# EAGLE design HomemadeHardware_Intro (EAGLE 9.5.2)
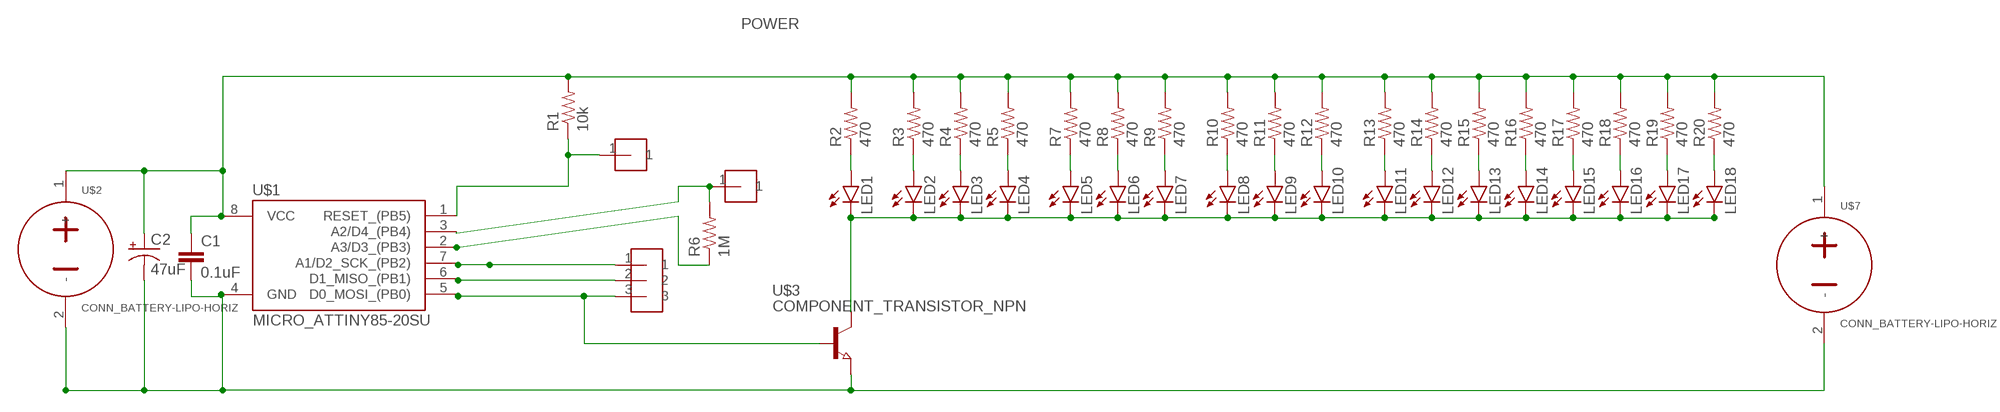
[diagram p0: schematic, sheet 1]

## Parts
C1  0.1uF  COMPONENT_CAP-0805  [0805]
C2  47uF  COMPONENT_CAP_POL-10MM  [CAP_RADIAL_CAN_8MM]
LED1  LED-0805  [CHIP-LED0805]
LED2  LED-0805  [CHIP-LED0805]
LED3  LED-0805  [CHIP-LED0805]
LED4  LED-0805  [CHIP-LED0805]
LED5  LED-0805  [CHIP-LED0805]
LED6  LED-0805  [CHIP-LED0805]
LED7  LED-0805  [CHIP-LED0805]
LED8  LED-0805  [CHIP-LED0805]
LED9  LED-0805  [CHIP-LED0805]
LED10  LED-0805  [CHIP-LED0805]
LED11  LED-0805  [CHIP-LED0805]
LED12  LED-0805  [CHIP-LED0805]
LED13  LED-0805  [CHIP-LED0805]
LED14  LED-0805  [CHIP-LED0805]
LED15  LED-0805  [CHIP-LED0805]
LED16  LED-0805  [CHIP-LED0805]
LED17  LED-0805  [CHIP-LED0805]
LED18  LED-0805  [CHIP-LED0805]
R1  10k  COMPONENT_RESISTOR-0805  [0805]
R2  470  COMPONENT_RESISTOR-0805  [0805]
R3  470  COMPONENT_RESISTOR-0805  [0805]
R4  470  COMPONENT_RESISTOR-0805  [0805]
R5  470  COMPONENT_RESISTOR-0805  [0805]
R6  1M  COMPONENT_RESISTOR-0805  [0805]
R7  470  COMPONENT_RESISTOR-0805  [0805]
R8  470  COMPONENT_RESISTOR-0805  [0805]
R9  470  COMPONENT_RESISTOR-0805  [0805]
R10  470  COMPONENT_RESISTOR-0805  [0805]
R11  470  COMPONENT_RESISTOR-0805  [0805]
R12  470  COMPONENT_RESISTOR-0805  [0805]
R13  470  COMPONENT_RESISTOR-0805  [0805]
R14  470  COMPONENT_RESISTOR-0805  [0805]
R15  470  COMPONENT_RESISTOR-0805  [0805]
R16  470  COMPONENT_RESISTOR-0805  [0805]
R17  470  COMPONENT_RESISTOR-0805  [0805]
R18  470  COMPONENT_RESISTOR-0805  [0805]
R19  470  COMPONENT_RESISTOR-0805  [0805]
R20  470  COMPONENT_RESISTOR-0805  [0805]
U$1  MICRO_ATTINY85-20SU  [SOIC8]
U$2  CONN_BATTERY-LIPO-HORIZ  [JST-PH-2-SMT-RA]
U$3  COMPONENT_TRANSISTOR_NPN  [SOT23]
U$4  HEADER-1-TESTPOINT  [TESTPOINT-1]
U$5  HEADER-1-TESTPOINT  [TESTPOINT-1]
U$6  HEADER-3-TESTPOINT  [TESTPOINT-3]
U$7  CONN_BATTERY-LIPO-HORIZ  [JST-PH-2-SMT-RA]

## Nets
N$1: R1.1 U$1.1(RESET_(PB5)) U$5.1
N$2: C1.2 C2.- U$1.4(GND) U$2.2(-) U$3.2(E) U$7.2(-)
N$4: LED14.A R16.1
N$5: R6.2 U$1.3(A2/D4_(PB4)) U$4.1
N$6: LED1.C LED2.C LED3.C LED4.C LED5.C LED6.C LED7.C LED8.C LED9.C LED10.C LED11.C LED12.C LED13.C LED14.C LED15.C LED16.C LED17.C LED18.C U$3.3(C)
N$7: LED4.A R5.1
N$8: LED3.A R4.1
N$9: LED2.A R3.1
N$10: LED1.A R2.1
N$11: R6.1 U$1.2(A3/D3_(PB3))
N$12: U$1.5(D0_MOSI_(PB0)) U$3.1(B) U$6.3
N$13: U$1.7(A1/D2_SCK_(PB2)) U$6.1
N$14: U$1.6(D1_MISO_(PB1)) U$6.2
N$16: LED7.A R9.1
N$17: LED6.A R8.1
N$18: LED5.A R7.1
N$19: LED15.A R17.1
N$21: LED10.A R12.1
N$22: LED9.A R11.1
N$23: LED8.A R10.1
N$24: LED16.A R18.1
N$26: LED13.A R15.1
N$27: LED12.A R14.1
N$28: LED11.A R13.1
N$29: LED17.A R19.1
N$31: LED18.A R20.1
POWER: C1.1 C2.+ R1.2 R2.2 R3.2 R4.2 R5.2 R7.2 R8.2 R9.2 R10.2 R11.2 R12.2 R13.2 R14.2 R15.2 R16.2 R17.2 R18.2 R19.2 R20.2 U$1.8(VCC) U$2.1(+) U$7.1(+)

## Library data of the parts
C1 = homemade-hardware:COMPONENT_CAP: Capacitor Standard 0603 ceramic capacitor, and 0.1" leaded capacitor.
C2 = homemade-hardware:COMPONENT_CAP_POL: Capacitor Polarized These are standard SMD and PTH capacitors. Normally 47uF, 100uF, and 470uF in electrolytic and tantalum varieties. Always verify the external diameter of the through hole cap, it varies with capacity, voltage, and manufacturer. The EIA devices should be standard.
LED1-LED18 = homemade-hardware:LED: LEDs Standard schematic elements and footprints for 5mm, 3mm, 1206, and 0603 sized LEDs. 5mm - Spark Fun Electronics SKU : COM-00529 (and others)
R1-R20 = homemade-hardware:COMPONENT_RESISTOR
U$1 = homemade-hardware:MICRO_ATTINY85
U$2 U$7 = homemade-hardware:CONN_BATTERY
U$3 = homemade-hardware:COMPONENT_TRANSISTOR_NPN: BSS806NH6327XTSA1 <https://www.digikey.com/product-detail/en/infineon-technologies/BSS806NH6327XTSA1/BSS806NH6327XTSA1DKR-ND/3196843>: NPN Moseft Transistor - 20V 2.3A; PN: BSS806NH6327XTSA1
U$4 U$5 = homemade-hardware:HEADER-1: M20-8890845 <https://www.digikey.com/products/en?keywords=952-3236-ND>: Horizontal Male SMD Headers M20-7910842R <https://www.digikey.com/product-detail/en/harwin-inc/M20-7910842R/952-3200-6-ND/6559341>: Horizontal Female SMD Headers
U$6 = homemade-hardware:HEADER-3: NPTC081KFXC-RC <https://www.digikey.com/product-detail/en/sullins-connector-solutions/NPTC081KFXC-RC/S5600-ND/776058>: Vertical Female SMD Headers TSM-110-01-T-SV <https://www.digikey.com/product-detail/en/samtec-inc/TSM-110-01-T-SV/SAM12267-ND/6691889>: Vertical Male SMD Headers M20-8890845 <https://www.digikey.com/products/en?keywords=952-3236-ND>: Horizontal Male SMD Headers M20-7910842R <https://www.digikey.com/product-detail/en/harwin-inc/M20-7910842R/952-3200-6-ND/6559341>: Horizontal Female SMD Headers

## Board
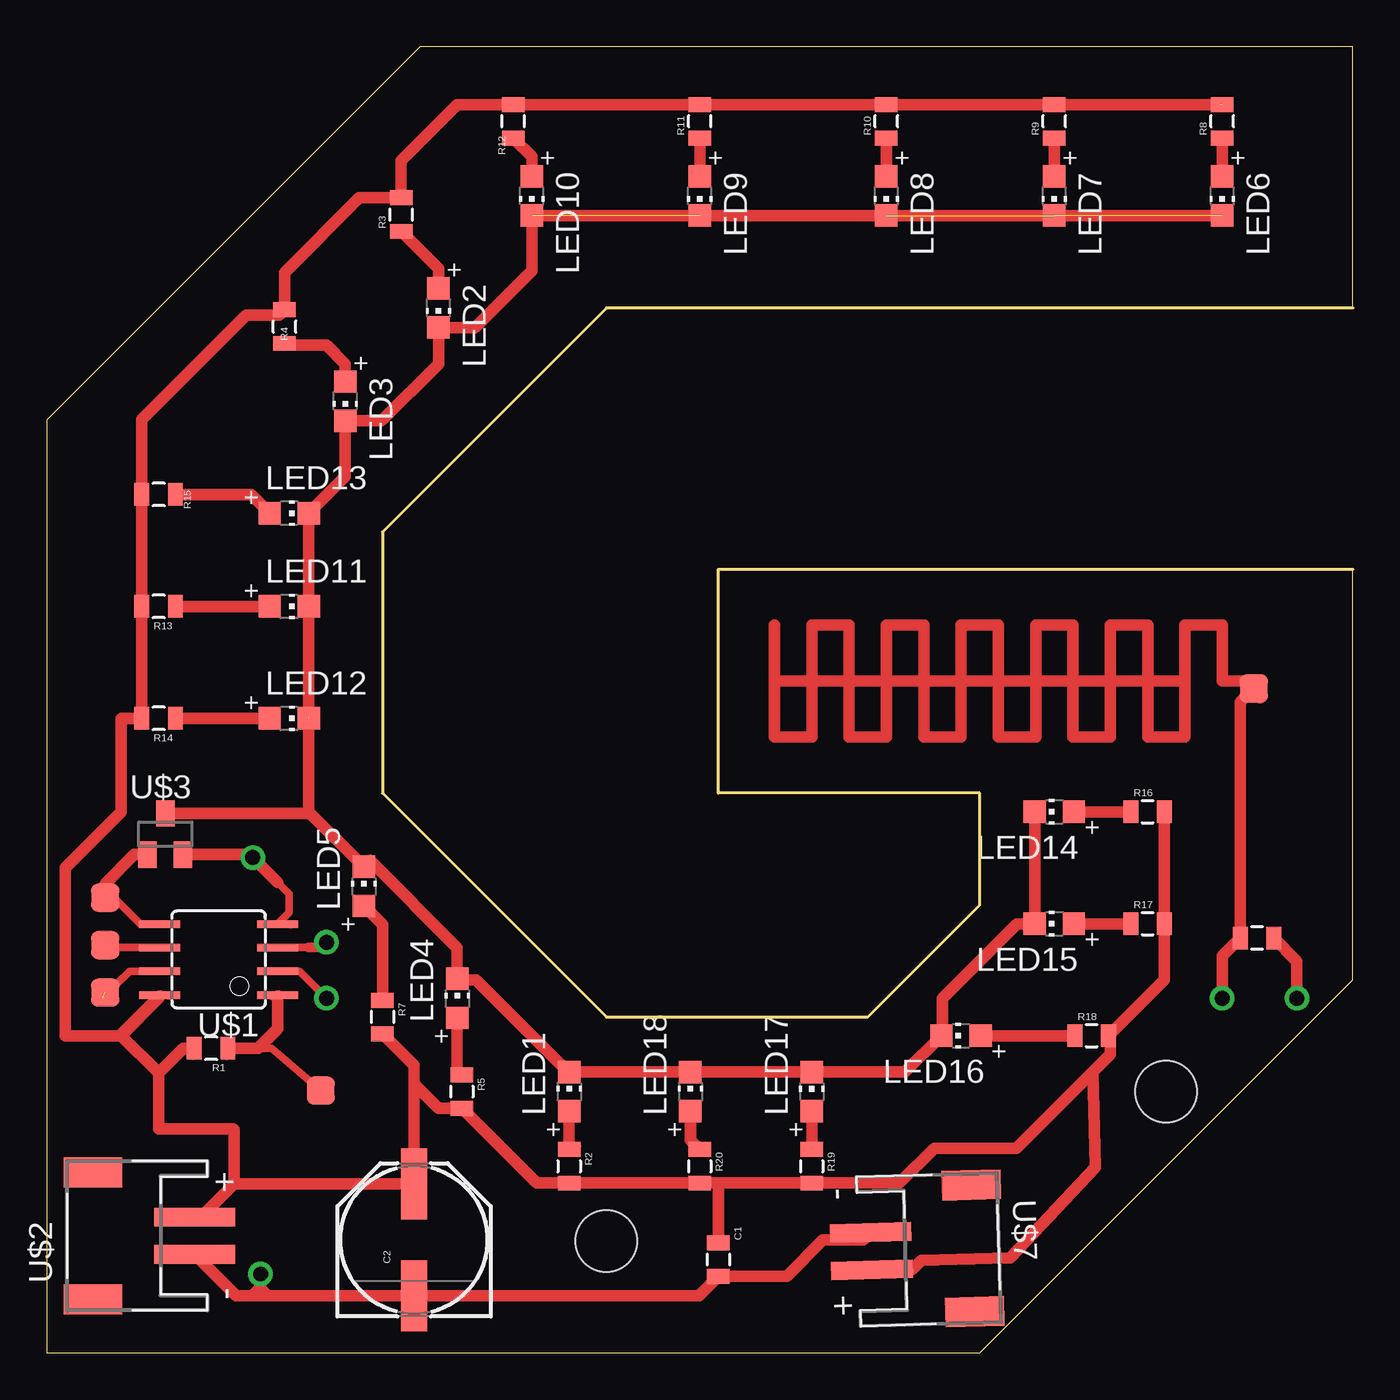
[diagram p1: board, top side]
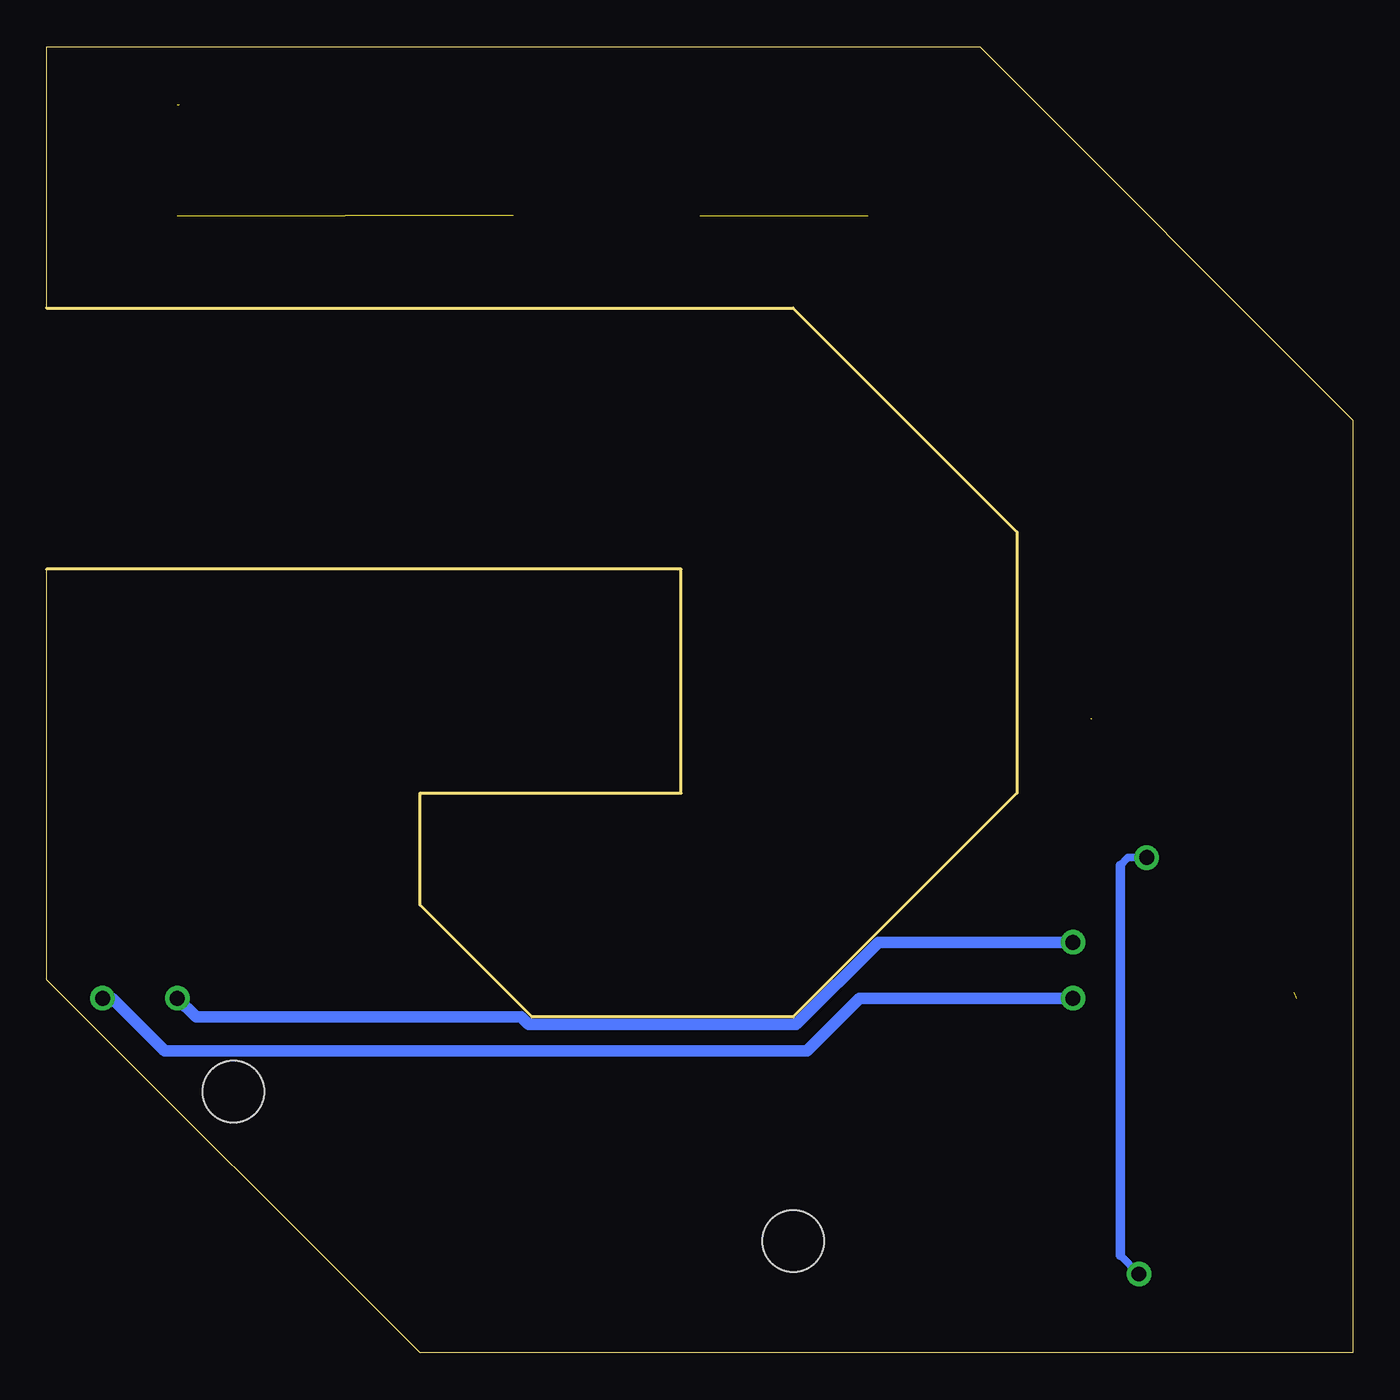
[diagram p2: board, bottom side, seen from below]

Size 70 x 70 mm. Coordinates in mm from the lower left corner, seen from the top.
Outline: 70,70 20,70 0,50 0,0 50,0 70,20 70,42 36,42 36,30 50,30 50,24 44,18 30,18 18,30 18,44 30,56 70,56 70,70
Copper layers (1*16): Top 0.035mm / dielectric 1.5mm / Bottom 0.035mm
Design rules "default": minimum track width 16mil, minimum drill 0.8mm, track to track 0.8mm, track to pad 0.8mm, pad to pad 0.8mm, via to via 0.8mm, smd to smd 0mil, copper to edge 1mil, drill to drill 1mil, minimum pad ring 10mil, minimum via ring 10mil, stop-mask expansion 1mil, vias tented up to drill 30mil, thermal gap 10mil
Holes 3.3 mm at 60,14 30,6

### Footprints (pad centres in the part's own frame; a part is rotated, then mirrored left to right if it is on the bottom)
0805 = smd 0.8 x 1.2: 1 -0.9,0; 2 0.9,0
CAP_RADIAL_CAN_8MM = smd 3.8 x 1.4: + 3,0; - -3,0
CHIP-LED0805 = smd 1.2 x 1.2: A 0,-1.05; C 0,1.05
SOIC8 = smd 0.4 x 2.2: 1 -1.905,-3.154; 2 -0.635,-3.154; 3 0.635,-3.154; 4 1.905,-3.154; 5 1.905,3.154; 6 0.635,3.154; 7 -0.635,3.154; 8 -1.905,3.154
JST-PH-2-SMT-RA = smd 1 x 4.35: 1 1,-3.825; 2 -1,-3.825 | smd 1.6 x 3.15: NC1 -3.4,1.625; NC2 3.4,1.625
SOT23 = smd 1 x 1.4: 1 -0.95,-1.1; 2 0.95,-1.1; 3 0,1.1
TESTPOINT-1 = smd 1.524 x 1.524: 1 0,0
TESTPOINT-3 = smd 1.524 x 1.524: 1 0,0; 2 2.54,0; 3 5.08,0

### Placement (x,y rotation side)
C1  36,5 270 top
C2  19.69,6.06 90 top
LED1  28,14 0 top
LED2  21,56 180 top
LED3  16,51 180 top
LED4  22,19 0 top
LED5  17,25 0 top
LED6  63,62 180 top
LED7  54,62 180 top
LED8  45,62 180 top
LED9  35,62 180 top
LED10  26,62 180 top
LED11  13,40 270 top
LED12  13,34 270 top
LED13  13,45 270 top
LED14  54,29 90 top
LED15  54,23 90 top
LED16  49,17 90 top
LED17  41,14 0 top
LED18  34.5,14 0 top
R1  8.82,16.33 180 top
R2  28,10 270 top
R3  19,61 90 top
R4  12.75,55 90 top
R5  22.25,14 270 top
R6  64.86,22.23 180 top
R7  18,18 270 top
R8  63,66 90 top
R9  54,66 90 top
R10  45,66 90 top
R11  35,66 90 top
R12  25,66 90 top
R13  6,40 180 top
R14  6,34 180 top
R15  6,46 180 top
R16  59,29 0 top
R17  59,23 0 top
R18  56,17 0 top
R19  41,10 270 top
R20  35,10 270 top
U$1  9.22,21.08 90 top
U$2  4.11,6.28 90 top
U$3  6.36,27.8 0 top
U$4  64.69,35.6 90 top
U$5  14.69,14.06 90 top
U$6  3.14,19.31 90 top
U$7  48.02,5.56 271.6 top

### Tracks (layer width: path | path; a pad name or v marks a point on that pad's centre or on a via)
N$1
  Top 0.406: 9.65,15.89 R1.1 | R1.1 12.05,16.33 U$5.1 | 12.06,19.11 U$1.1 12.37,19.14 | R1.1 10,16.33
  Top 0.61: 10,16.33 11.33,16.33 12.37,17.37 12.37,19.14
N$2  (via drill 0.8)
  Top 0.406: 19.3,3.62 C2.- 12,3.06 | 11.46,3.62 v11.46,4.22 11.46,3.6 12,3.06 | 10.89,26.7 v11.05,26.54 | 13.08,22.92 13.02,22.98 12.41,22.98 | 11,3.06 12,3.06 | 12.41,22.98 U$1.4 13,23.61 13,24.59 12.37,25.21 | 12.37,23.02 12.41,22.98
  Top 0.61: U$2.2 10.16,3.06 11,3.06 | 11,3.06 C2.- 34.96,3.06 C1.2 39.66,4.1 41.61,6.05 43.76,6.05 U$7.2 | v11.46,4.22 11.46,3.52 11,3.06 | U$3.2 10.89,26.7 | 11.37,26.54 v11.05,26.54 12.37,25.21
  Bottom 0.406: 12.46,5.22 v11.46,4.22 | v11.05,26.54 12.05,26.54 12.46,26.13
  Bottom 0.508: 12.46,26.13 12.46,5.22
N$3
  Top 0.406: 65,36 65,35
  Top 0.61: 39,39 39,36 | 39,36 39,33 41,33 41,39 43,39 43,33 45,33 45,39 47,39 47,33 49,33 49,39 51,39 51,33 53,33 53,39 55,39 55,33 57,33 57,39 59,39 59,33 61,33 61,36 | 61,36 61,39 63,39 63,36 65,36 | 39,36 61,36
N$4
  Top 0.61: R16.1 LED14.A
N$5  (via drill 0.8)
  Top 0.406: 14,21.71 U$1.3
  Top 0.508: v15,22 14.71,21.71 14,21.71
  Top 0.61: R6.2 63.96,34.87 U$4.1 | R6.2 63.96,21.93 | R6.2 63,21.27 v63,19
  Bottom 0.61: v63,19 62,18 44.58,18 44.17,17.59 29.83,17.59 25.43,22 v15,22
N$6  (4 unrouted)
  Top 0.406: 17.28,25.91 LED5.C
  Top 0.61: LED6.C LED10.C 26,58 22.95,54.95 LED2.C 21,53 17.95,49.95 LED3.C 16,46.95 LED13.C LED11.C 14.05,34.05 14,34 | LED12.C 14.05,29 | 14.05,29 LED5.C 17.33,26.38 22,21.71 LED4.C 22.05,20 23,20 27.95,15.05 LED1.C | LED1.C | LED14.C LED15.C 52,23 48,19 48,17.05 LED16.C 46,15.05 LED17.C LED18.C | U$3.3 13.95,28.9 14.05,29 | LED18.C | LED18.C LED1.C | LED1.C
N$7
  Top 0.406: 22.06,15.07 R5.1 | 22.06,17.49 LED4.A
  Top 0.61: LED4.A 22,15.13 22.06,15.07
N$8
  Top 0.61: R4.1 12.85,54 15,54 16,53 LED3.A
N$9
  Top 0.61: R3.1 21,58.1 LED2.A
N$10
  Top 0.406: 28.44,11.07 R2.1
  Top 0.61: LED1.A R2.1
N$11  (via drill 0.8)
  Top 0.406: U$1.2 13.55,20.45 v15,19
  Top 0.61: R6.1 67,20.99 v67,19
  Bottom 0.61: v15,19 26.43,19 29.25,16.18 63.67,16.18 66.49,19 v67,19
N$12
  Top 0.406: U$1.5 5.01,22.99 3.61,24.39 U$6.3 3.32,24.39 3.32,25.32 4.7,26.7
  Top 0.61: U$6.3 3.14,25.14 4.7,26.7 U$3.1
N$13  (1 unrouted)
  Top 0.406: U$1.7 4.46,20.45 4.09,20.09 4.08,20.09 3,19
N$14
  Top 0.406: U$1.6 3.27,21.71 U$6.2
N$16
  Top 0.61: R9.1 LED7.A
N$17
  Top 0.61: R8.1 LED6.A
N$18
  Top 0.406: 17.78,19.07 R7.1
  Top 0.61: LED5.A 18,22.95 R7.1
N$19
  Top 0.61: R17.1 LED15.A
N$21
  Top 0.61: R12.1 26,64.1 LED10.A
N$22
  Top 0.61: R11.1 LED9.A
N$23
  Top 0.61: R10.1 LED8.A
N$24
  Top 0.61: R18.1 LED16.A
N$26
  Top 0.61: R15.1 10.95,46 LED13.A
N$27
  Top 0.61: R14.1 LED12.A
N$28
  Top 0.61: R13.1 LED11.A
N$29
  Top 0.61: LED17.A R19.1
N$31
  Top 0.61: LED18.A 34.5,11.4 R20.1
POWER  (1 unrouted)
  Top 0.406: 28.44,9.26 R2.2 27.84,9.26 | 6.63,19.11 U$1.8 3.89,17 | 7.84,15.89 R1.2 | 7.84,7.24 U$2.1 8.02,7.27 | 8.45,7.24 8.02,7.27 | 8.02,7.27 8.27,7.27 8.5,7.5 | 10.06,9.06 10,9.11 10,12 | 1,17 3.89,17 | 4,17 3.89,17
  Top 0.61: 4,17 1,17 1,26 4,29 4,34 R14.2 R13.2 R15.2 5.1,50.01 10.69,55.6 12.46,55.6 R4.2 12.75,57.9 16.75,61.9 R3.2 19,63.9 22,66.9 R12.2 R11.2 R10.2 R9.2 R8.2 | 4,17 4,17.05 6.07,19.12 6.07,19.07 4,17 | 6,15 4,17 | R1.2 7.33,16.33 6,15 | 6,15 6,12 10,12 10.06,11.94 10.06,9.06 | 10.06,9.06 8.5,7.5 | 10.06,9.06 C2.+ 19.69,14.41 | 62.9,66.9 63,67 | R7.2 19.69,15.41 19.69,14.41 | 19.69,14.41 21,13.1 R5.2 26.25,9.1 R2.2 R20.2 36,9.1 | 36,9.1 R19.2 45.71,9.1 47.58,10.96 51.97,10.96 56.06,15.06 | 56.06,15.06 57,16 57,16.9 R18.2 59.9,20 R17.2 R16.2 | C1.1 36,9.1 | 56.06,15.06 56.2,9.93 51.64,5.1 46.89,4.97 46.38,4.45 U$7.1